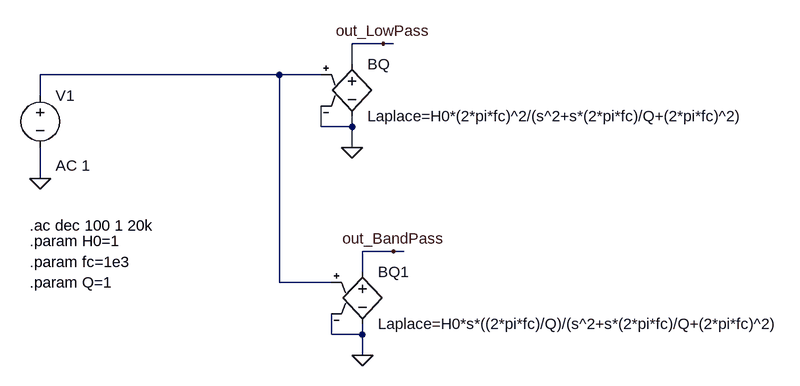
[diagram p0: schematic Laplace_fdt_2nd_order.asc]
Laplace_fdt_2nd_order.asc, the LTspice schematic file:
Version 4
SHEET 1 2564 1736
WIRE 1760 416 1712 416
WIRE 1776 416 1760 416
WIRE 1712 448 1712 416
WIRE 1600 464 1232 464
WIRE 1664 464 1600 464
WIRE 1232 496 1232 464
WIRE 1664 544 1664 512
WIRE 1712 544 1712 528
WIRE 1712 544 1664 544
WIRE 1712 576 1712 544
WIRE 1232 624 1232 576
WIRE 1776 736 1728 736
WIRE 1792 736 1776 736
WIRE 1728 768 1728 736
WIRE 1600 784 1600 464
WIRE 1680 784 1600 784
WIRE 1680 864 1680 832
WIRE 1728 864 1728 848
WIRE 1728 864 1680 864
WIRE 1728 896 1728 864
FLAG 1232 624 0
FLAG 1712 576 0
FLAG 1760 416 out_LowPass
FLAG 1728 896 0
FLAG 1776 736 out_BandPass
SYMBOL voltage 1232 480 R0
WINDOW 123 24 124 Left 2
WINDOW 39 0 0 Left 0
SYMATTR Value2 AC 1
SYMATTR InstName V1
SYMATTR Value ""
SYMBOL e 1712 432 R0
SYMATTR InstName BQ
SYMATTR Value Laplace=H0*(2*pi*fc)^2/(s^2+s*(2*pi*fc)/Q+(2*pi*fc)^2)
SYMBOL e 1728 752 R0
SYMATTR InstName BQ1
SYMATTR Value Laplace=H0*s*((2*pi*fc)/Q)/(s^2+s*(2*pi*fc)/Q+(2*pi*fc)^2)
TEXT 1216 696 Left 2 !.ac dec 100 1 20k
TEXT 1216 720 Left 2 !.param H0=1
TEXT 1216 752 Left 2 !.param fc=1e3
TEXT 1216 784 Left 2 !.param Q=1

The netlist it stands for:
* Laplace_fdt_2nd_order.asc
V1 N001 0 AC 1
E§BQ out_LowPass 0 N001 0 Laplace=H0*(2*pi*fc)^2/(s^2+s*(2*pi*fc)/Q+(2*pi*fc)^2)
E§BQ1 out_BandPass 0 N001 0 Laplace=H0*s*((2*pi*fc)/Q)/(s^2+s*(2*pi*fc)/Q+(2*pi*fc)^2)
.ac dec 100 1 20k
.param H0=1
.param fc=1e3
.param Q=1
.backanno
.end